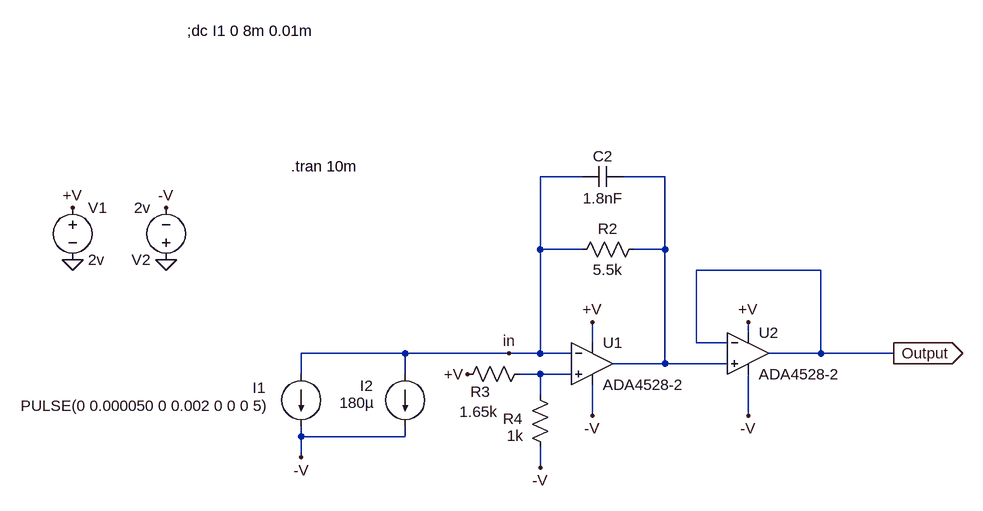
[diagram p0: schematic SimpleAmpCircuit.asc]
SimpleAmpCircuit.asc, the LTspice schematic file:
Version 4
SHEET 1 880 680
WIRE 16 -144 -48 -144
WIRE 144 -144 80 -144
WIRE -48 -32 -48 -144
WIRE 16 -32 -48 -32
WIRE 144 -32 144 -144
WIRE 144 -32 96 -32
WIRE 384 0 192 0
WIRE 272 96 272 80
WIRE 32 112 32 80
WIRE 192 112 192 0
WIRE 240 112 192 112
WIRE -256 128 -416 128
WIRE -96 128 -256 128
WIRE -48 128 -48 -32
WIRE -48 128 -96 128
WIRE 0 128 -48 128
WIRE 384 128 384 0
WIRE 384 128 304 128
WIRE 496 128 384 128
WIRE 144 144 144 -32
WIRE 144 144 64 144
WIRE 240 144 144 144
WIRE -416 160 -416 128
WIRE -256 160 -256 128
WIRE -48 160 -80 160
WIRE 0 160 -48 160
WIRE -48 192 -48 160
WIRE 32 224 32 176
WIRE 272 224 272 160
WIRE -416 256 -416 240
WIRE -256 256 -256 240
WIRE -256 256 -416 256
WIRE -416 288 -416 256
WIRE -48 304 -48 272
FLAG 496 128 Output
IOPIN 496 128 Out
FLAG -768 -16 0
FLAG -768 -96 +V
FLAG -96 128 in
FLAG -624 -16 0
FLAG -624 -96 -V
FLAG 32 80 +V
FLAG 272 80 +V
FLAG -160 160 +V
FLAG -48 304 -V
FLAG 32 224 -V
FLAG 272 224 -V
FLAG -416 288 -V
SYMBOL res 112 -48 R90
WINDOW 0 0 56 VBottom 2
WINDOW 3 32 56 VTop 2
SYMATTR InstName R2
SYMATTR Value 5.5k
SYMBOL voltage -768 -112 R0
WINDOW 123 0 0 Left 0
WINDOW 39 0 0 Left 0
SYMATTR InstName V1
SYMATTR Value 2v
SYMBOL current -416 160 R0
WINDOW 123 0 0 Left 0
WINDOW 39 0 0 Left 0
WINDOW 0 -55 21 Right 2
WINDOW 3 -47 49 Right 2
SYMATTR InstName I1
SYMATTR Value PULSE(0 0.000050 0 0.002 0 0 0 5)
SYMBOL cap 80 -160 R90
WINDOW 0 0 32 VBottom 2
WINDOW 3 34 31 VTop 2
SYMATTR InstName C2
SYMATTR Value 1.8nF
SYMBOL res -64 144 R90
WINDOW 0 59 76 VBottom 2
WINDOW 3 58 79 VTop 2
SYMATTR InstName R3
SYMATTR Value 1.65k
SYMBOL res -32 288 R180
WINDOW 0 43 59 Left 2
WINDOW 3 42 33 Left 2
SYMATTR InstName R4
SYMATTR Value 1k
SYMBOL voltage -624 0 R180
WINDOW 123 0 0 Left 0
WINDOW 39 0 0 Left 0
SYMATTR InstName V2
SYMATTR Value 2v
SYMBOL current -256 160 R0
WINDOW 123 0 0 Left 0
WINDOW 39 0 0 Left 0
WINDOW 0 -49 18 Right 2
WINDOW 3 -47 44 Right 2
SYMATTR InstName I2
SYMATTR Value 180µ
SYMBOL OpAmps\\ADA4528-2 32 80 R0
SYMATTR InstName U1
SYMBOL OpAmps\\ADA4528-2 272 64 R0
SYMATTR InstName U2
TEXT -592 -368 Left 2 !;dc I1 0 8m 0.01m
TEXT -432 -160 Left 2 !.tran 10m

The netlist it stands for:
* SimpleAmpCircuit.asc
R2 N001 in 5.5k
V1 +V 0 2v
I1 in -V PULSE(0 0.000050 0 0.002 0 0 0 5)
C2 N001 in 1.8nF
R3 N002 +V 1.65k
R4 -V N002 1k
V2 0 -V 2v
I2 in -V 180µ
XU1 N002 in +V -V N001 ADA4528-2  ; pins In+ In- V+ V- OUT
XU2 N001 Output +V -V Output ADA4528-2  ; pins In+ In- V+ V- OUT
;dc I1 0 8m 0.01m
.tran 10m
.backanno
.end